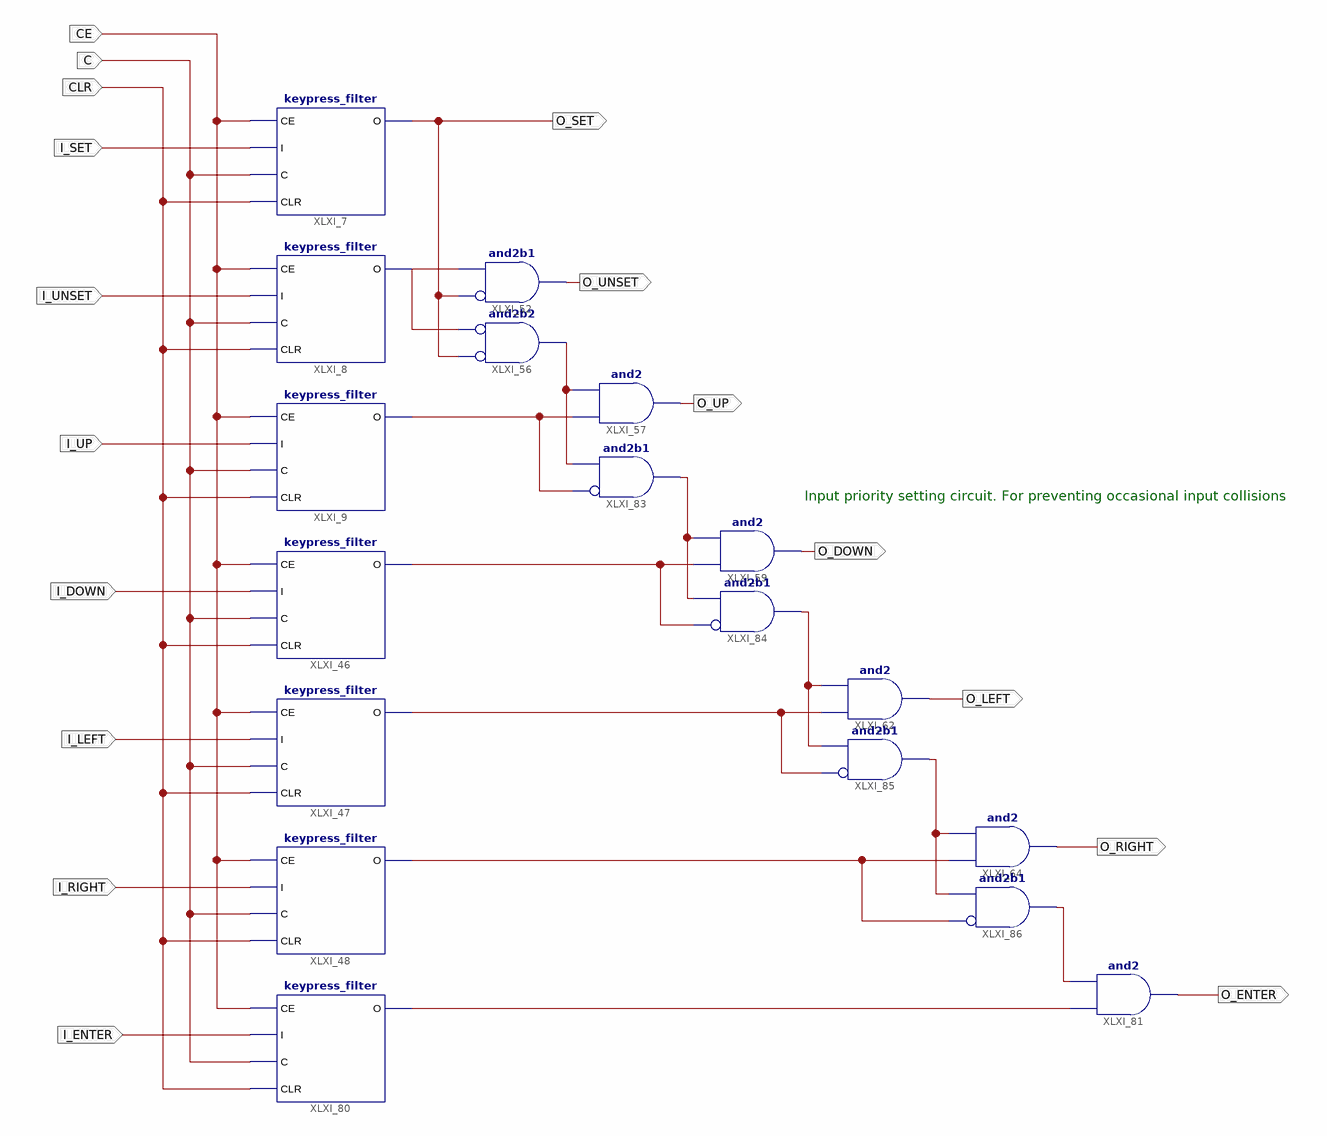
[diagram p0: schematic sheet 1]
// Xilinx ISE schematic input_process.sch (spartan6) as structural Verilog: 18 symbols, 18 ports
module input_process (
  input  CE,
  input  C,
  input  CLR,
  input  I_SET,
  input  I_UNSET,
  input  I_UP,
  input  I_DOWN,
  input  I_LEFT,
  input  I_RIGHT,
  input  I_ENTER,
  output XLXN_41,
  output O_UNSET,
  output O_UP,
  output O_LEFT,
  output O_DOWN,
  output O_RIGHT,
  output O_ENTER,
  output O_SET
);

  wire XLXN_42, XLXN_48, XLXN_50, XLXN_54, XLXN_56, XLXN_63, XLXN_64, XLXN_103, XLXN_108, XLXN_109;

  keypress_filter XLXI_8 (.C(C), .CE(CE), .CLR(CLR), .I(I_UNSET), .O(XLXN_41));
  keypress_filter XLXI_9 (.C(C), .CE(CE), .CLR(CLR), .I(I_UP), .O(XLXN_48));
  keypress_filter XLXI_47 (.C(C), .CE(CE), .CLR(CLR), .I(I_LEFT), .O(XLXN_63));
  keypress_filter XLXI_48 (.C(C), .CE(CE), .CLR(CLR), .I(I_RIGHT), .O(XLXN_108));
  keypress_filter XLXI_46 (.C(C), .CE(CE), .CLR(CLR), .I(I_DOWN), .O(XLXN_54));
  keypress_filter XLXI_7 (.C(C), .CE(CE), .CLR(CLR), .I(I_SET), .O(O_SET));
  and XLXI_52 (O_UNSET, ~O_SET, XLXN_41);  // and2b1
  and XLXI_56 (XLXN_42, ~O_SET, ~XLXN_41);  // and2b2
  and XLXI_57 (O_UP, XLXN_48, XLXN_42);
  and XLXI_59 (O_DOWN, XLXN_54, XLXN_50);
  and XLXI_62 (O_LEFT, XLXN_63, XLXN_56);
  and XLXI_64 (O_RIGHT, XLXN_108, XLXN_64);
  keypress_filter XLXI_80 (.C(C), .CE(CE), .CLR(CLR), .I(I_ENTER), .O(XLXN_103));
  and XLXI_81 (O_ENTER, XLXN_103, XLXN_109);
  and XLXI_83 (XLXN_50, ~XLXN_48, XLXN_42);  // and2b1
  and XLXI_84 (XLXN_56, ~XLXN_54, XLXN_50);  // and2b1
  and XLXI_85 (XLXN_64, ~XLXN_63, XLXN_56);  // and2b1
  and XLXI_86 (XLXN_109, ~XLXN_108, XLXN_64);  // and2b1

  // Notes on the sheet:
  //   Input priority setting circuit. For preventing occasional input collisions
endmodule
